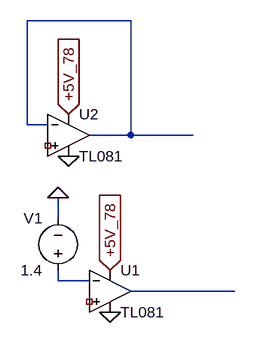
[diagram p0: schematic V_Designs.asc]
V_Designs.asc, the LTspice schematic file:
Version 4
SHEET 1 880 680
WIRE 144 -80 -16 -80
WIRE -16 80 -16 -80
WIRE 16 80 -16 80
WIRE 144 96 144 -80
WIRE 144 96 80 96
WIRE 240 96 144 96
WIRE 32 224 32 192
WIRE 32 320 32 304
WIRE 80 320 32 320
WIRE 304 336 144 336
FLAG 112 304 +5V_78
IOPIN 112 304 In
FLAG 112 368 0
FLAG 32 192 0
FLAG 48 64 +5V_78
IOPIN 48 64 In
FLAG 48 128 0
SYMBOL Opamps\\opamp2 112 272 R0
SYMATTR InstName U1
SYMATTR Value TL081
SYMBOL voltage 32 320 R180
WINDOW 0 24 96 Left 2
WINDOW 3 24 16 Left 2
WINDOW 123 0 0 Left 0
WINDOW 39 0 0 Left 0
SYMATTR InstName V1
SYMATTR Value 1.4
SYMBOL Opamps\\opamp2 48 32 R0
SYMATTR InstName U2
SYMATTR Value TL081

The netlist it stands for:
* V_Designs.asc
XU1 NC_01 N002 +5V_78 0 N003 TL081  ; pins In+ In- V+ V- OUT
V1 N002 0 1.4
XU2 NC_02 N001 +5V_78 0 N001 TL081  ; pins In+ In- V+ V- OUT
.backanno
.end